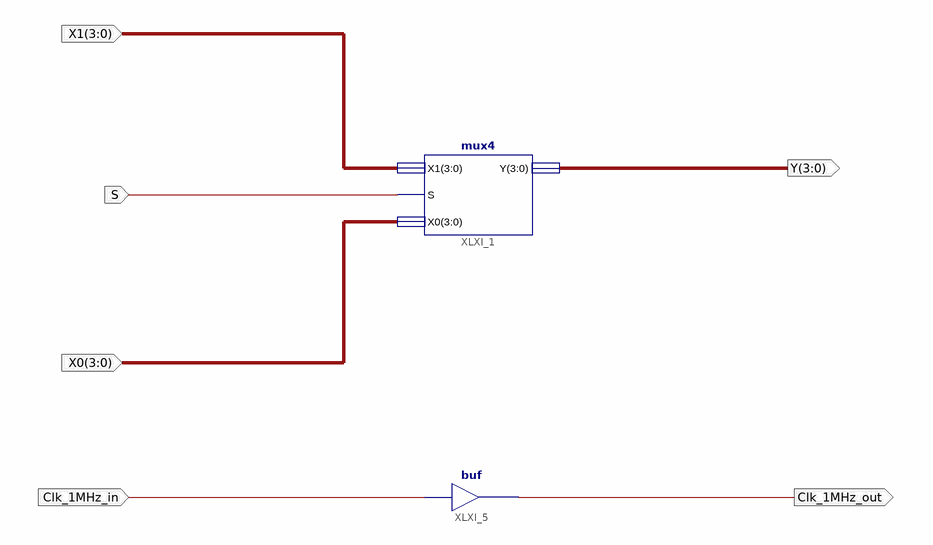
[diagram p0: schematic sheet 1]
// Xilinx ISE schematic board_mux4.sch (spartan3e) as structural Verilog: 2 symbols, 6 ports
module board_mux4 (
  input  [3:0] X1,
  input  [3:0] X0,
  input  S,
  input  Clk_1MHz_in,
  output [3:0] Y,
  output Clk_1MHz_out
);

  mux4 XLXI_1 (.S(S), .X0(X0), .X1(X1), .Y(Y));
  buf XLXI_5 (Clk_1MHz_out, Clk_1MHz_in);
endmodule
